# EAGLE schematic capture infrarouge (EAGLE 9.1.0)
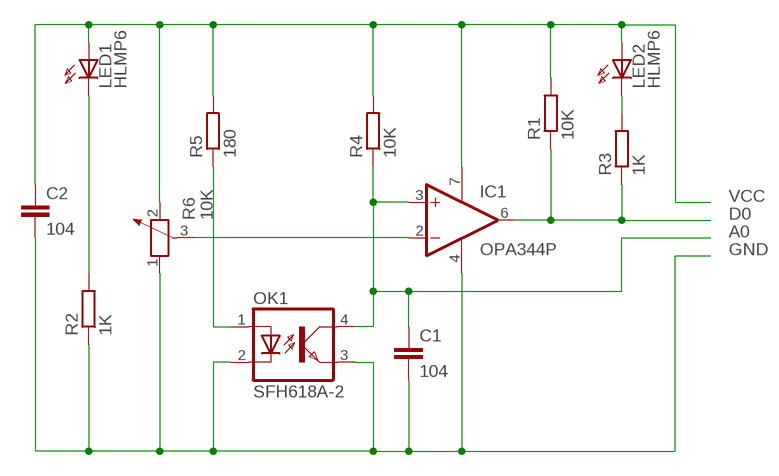
[diagram p0: schematic, sheet 1]

## Parts
C1  104  C-EU025-024X044  [C025-024X044]
C2  104  C-EU025-024X044  [C025-024X044]
IC1  OPA344P  [DIL08]
LED1  HLMP6  [HLMP6]
LED2  HLMP6  [HLMP6]
OK1  SFH618A-2  [DIP4]
R1  10K  R-EU_0204/2V  [0204V]
R2  1K  R-EU_0204/2V  [0204V]
R3  1K  R-EU_0204/2V  [0204V]
R4  10K  R-EU_0204/2V  [0204V]
R5  180  R-EU_0204/2V  [0204V]
R6  10K  POTENTIOMETER_PT-10  [PT-10]

## Nets
A0: C1.1 IC1.3(+IN) OK1.4(COL) R4.1
D0: IC1.6(OUT) R1.1 R3.1
GND: C1.2 C2.2 IC1.4(V-) OK1.2(C) OK1.3(EMIT) R2.1 R6.1
N$3: IC1.2(-IN) R6.3
N$5: OK1.1(A) R5.1
N$6: LED1.K R2.2
N$8: LED2.K R3.2
VCC: C2.1 IC1.7(V+) LED1.A LED2.A R1.2 R4.2 R5.2 R6.2

## Library data of the parts
C1 C2 = rcl:C-EU: CAPACITOR, European symbol; SPICEPREFIX: C
IC1 = linear:OPA*: Single Operational Amplifier Low Power, Single-Supply, Rail-To-Rail Operational Amplifier Source: http://focus.ti.com/lit/ds/symlink/opa2345.pdf
LED1 LED2 = display-hp:HLMP6: LED 2mm horizontal; MF: AGILENT TECHNOLOGIES; MPN: HLMP-6500; OC_FARNELL: 1652490; OC_NEWARK: 40K0088
OK1 = optocoupler:SFH618?*: Optocoupler, Phototransistor Output, Low Input Current Source: Data sheet <http://www.vishay.com/docs/83673/sfh618.pdf>; MF: VISHAY/TELEFUNKEN; MPN: SFH618A-2; OC_FARNELL: 6424855; OC_NEWARK: 21H7744
R1-R5 = resistor:R-EU_: RESISTOR, European symbol
R6 = rcl:POTENTIOMETER_: Potentiometer; SPICEMODEL: POT; SPICEPREFIX: X